# EAGLE design pam2803 (EAGLE 5.12)
DATABASE: ../../../partsdb.txt; PARTNO: CRL1206-FW-R820ELF
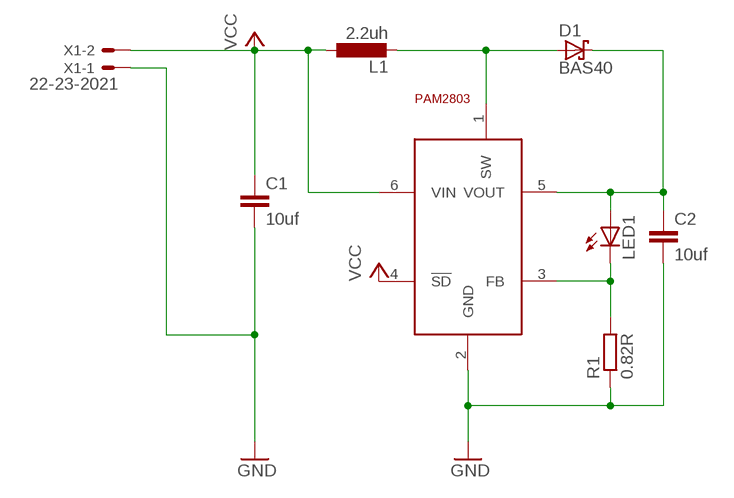
[diagram p0: schematic, sheet 1]

## Parts
C1  10uf  C-EUC1206  [C1206]
C2  10uf  C-EUC1206  [C1206]
D1  BAS40  [SOT23]
L1  2.2uh  L-EUL2012C  [L2012C]
LED1  LED5MM  [LED5MM]
R1  0.82R  R-EU_R1206  [R1206]
U$1  PAM2803  [SOT23-6]
X1  22-23-2021  [22-23-2021]

## Nets
GND: C1.2 C2.2 R1.1 U$1.2(GND) X1.1
LED+: C2.1 D1.3(C) LED1.A U$1.5(VOUT)
N$2: LED1.K(C) R1.2 U$1.3(FB)
N$3: D1.1(A) L1.2 U$1.1(SW)
VCC: C1.1 L1.1 U$1.4(!SD) U$1.6(VIN) X1.2

## Library data of the parts
C1 C2 = matt rcl:C-EU: CAPACITOR, European symbol
D1 = diode:BAS40: Silicon Schottky Diodes General-purpose diode for high-speed switching
L1 = matt rcl:L-EU: INDUCTOR, European symbol
LED1 = matt led:LED: LED OSRAM: - CHIPLED LG R971, LG N971, LY N971, LG Q971, LY Q971, LO R971, LY R971 LH N974, LH R974 LS Q976, LO Q976, LY Q976 LO Q996 - Hyper CHIPLED LW Q18S LB Q993, LB Q99A, LB R99A - SideLED LS A670, LO A670, LY A670, LG A670, LP A670 LB A673, LV A673, LT A673, LW A673 LH A674 LY A675 LS A676, LA A676, LO A676, LY A676, LW A676 LS A679, LY A679, LG A679 - Hyper Micro SIDELED® LS Y876, LA Y876, LO Y876, LY Y876 LT Y87S - SmartLED LW L88C, LW L88S LB L89C, LB L89S, LG L890 LS L89K, LO L89K, LY L89K LS L896, LA L896, LO L896, LY L896 - TOPLED LS T670, LO T670, LY T670, LG T670, LP T670 LSG T670, LSP T670, LSY T670, LOP T670, LYG T670 LG T671, LOG T671, LSG T671 LB T673, LV T673, LT T673, LW T673 LH T674 LS T676, LA T676, LO T676, LY T676, LB T676, LH T676, LSB T676, LW T676 LB T67C, LV T67C, LT T67C, LS T67K, LO T67K, LY T67K, LW E67C LS E67B, LA E67B, LO E67B, LY E67B, LB E67C, LV E67C, LT E67C LW T67C LS T679, LY T679, LG T679 LS T770, LO T770, LY T770, LG T770, LP T770 LB T773, LV T773, LT T773, LW T773 LH T774 LS E675, LA E675, LY E675, LS T675 LS T776, LA T776, LO T776, LY T776, LB T776 LHGB T686 LT T68C, LB T68C - Hyper Mini TOPLED® LB M676 - Mini TOPLED Santana® LG M470 LS M47K, LO M47K, LY M47K Source: http://www.osram.convergy.de LUXEON: - LUMILED® LXK2-PW12-R00, LXK2-PW12-S00, LXK2-PW14-U00, LXK2-PW14-V00 LXK2-PM12-R00, LXK2-PM12-S00, LXK2-PM14-U00 LXK2-PE12-Q00, LXK2-PE12-R00, LXK2-PE12-S00, LXK2-PE14-T00, LXK2-PE14-U00 LXK2-PB12-K00, LXK2-PB12-L00, LXK2-PB12-M00, LXK2-PB14-N00, LXK2-PB14-P00, LXK2-PB14-Q00 LXK2-PR12-L00, LXK2-PR12-M00, LXK2-PR14-Q00, LXK2-PR14-R00 LXK2-PD12-Q00, LXK2-PD12-R00, LXK2-PD12-S00 LXK2-PH12-R00, LXK2-PH12-S00 LXK2-PL12-P00, LXK2-PL12-Q00, LXK2-PL12-R00 Source: www.luxeon.com KINGBRIGHT: KA-3528ASYC Source: www.kingbright.com
R1 = matt rcl:R-EU_: RESISTOR, European symbol
U$1 = matt:PAM2803
X1 = con-molex:22-23-2021: .100" (2.54mm) Center Header - 2 Pin; MF: MOLEX; MPN: 22-23-2021; OC_FARNELL: 1462926; OC_NEWARK: 25C3832

## Board
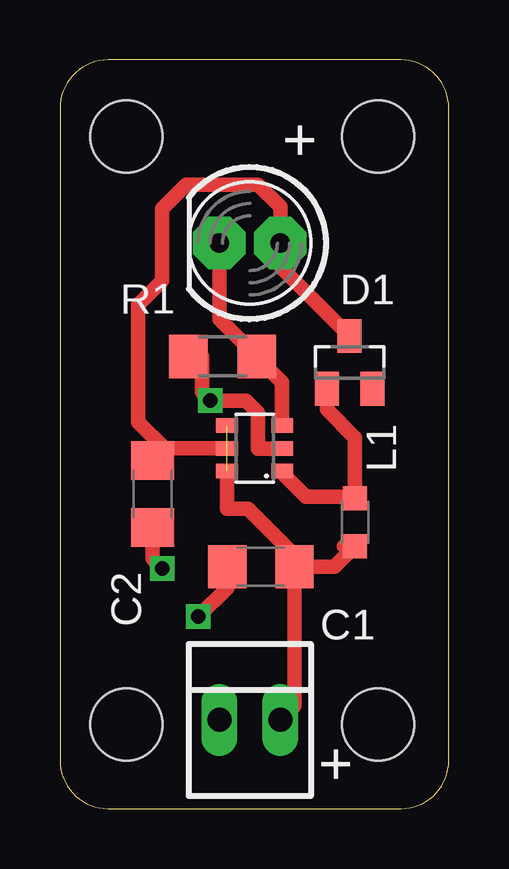
[diagram p1: board, top side]
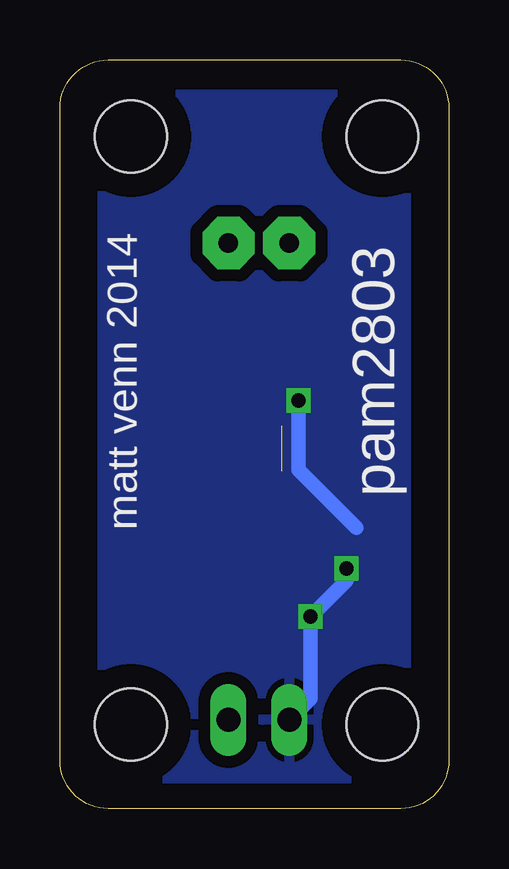
[diagram p2: board, bottom side, seen from below]

Size 16.22 x 31.19 mm. Coordinates in mm from the lower left corner, seen from the top.
Outline: 14.22,0 arc90 16.22,2 16.22,29.19 arc90 14.22,31.19 2,31.19 arc90 0,29.19 0,2 arc90 2,0 14.22,0
Copper layers (1*16): Top 0.035mm / dielectric 1.5mm / Bottom 0.035mm
Design rules "default": minimum track width 10mil, minimum drill 24mil, track to track 8mil, track to pad 8mil, pad to pad 8mil, via to via 8mil, smd to smd 8mil, copper to edge 40mil, drill to drill 8mil, minimum pad ring 10mil, minimum via ring 8mil, stop-mask expansion 4mil, vias tented up to drill 0mil, thermal gap 10mil
Holes 3 mm at 2.77,28 13.27,28 2.77,3.5 13.27,3.5

### Footprints (pad centres in the part's own frame; a part is rotated, then mirrored left to right if it is on the bottom)
C1206 = smd 1.6 x 1.8: 1 -1.4,0; 2 1.4,0
SOT23 = smd 1 x 1.4: 1 -0.95,-1.1; 2 0.95,-1.1; 3 0,1.1
L2012C = smd 1 x 1: 1 -1,0; 2 1,0
LED5MM = drill 0.813 pad 2.184 octagon: A -1.27,0; K 1.27,0
R1206 = smd 1.6 x 1.803: 1 -1.422,0; 2 1.422,0
SOT23-6 = smd 0.6 x 0.9: 1 -0.95,-1.15; 2 0,-1.15; 3 0.95,-1.15; 4 0.95,1.15; 5 0,1.15; 6 -0.95,1.15
22-23-2021 = drill 1 long: 1 -1.27,0; 2 1.27,0

### Placement (x,y rotation side)
C1  8.38,10.07 180 top
C2  3.86,13.11 270 top
D1  12.08,18.59 0 top
L1  12.31,11.93 90 top
LED1  7.92,23.56 180 top
R1  6.78,18.84 0 top
U$1  8.12,15.01 90 top
X1  7.92,3.69 0 top

### Tracks (layer width: path | path; a pad name or v marks a point on that pad's centre or on a via)
GND  (via drill 0.6)
  Top 0.61: R1.1 5.93,18.84 5.93,17.34 v6.27,17 7.77,17 8.27,16.5 8.27,15 U$1.2 | C1.2 6.98,9.21 v5.77,8 | C2.2 3.86,10.41 v4.27,10
  Bottom 0.61: X1.1 5.77,4.57 v5.77,8 4.27,9.5 v4.27,10 | v6.27,17 6.27,14.12 C2.2
  pour Bottom (isolate 0.5): 1.77,29.75 14.47,29.75 14.47,1.27 1.77,1.27
LED+
  Top 0.61: 4.36,15.01 U$1.5 | C2.1 4.36,15.01 | D1.3 9.19,22.58 LED1.A 9.19,25.08 8.27,26 5.27,26 4.27,25 4.27,22 3.27,21 3.27,16.1 4.36,15.01
N$2
  Top 0.61: LED1.K 6.65,20.39 R1.2 9.27,17.77 U$1.3
N$3
  Top 0.61: L1.2 11.84,12.93 | U$1.1 9.33,14 arc45 9.37,13.9 10.27,13 12.14,13 arc-45 L1.2 | D1.1 11.13,16.64 12.31,15.46 L1.2
VCC  (1 unrouted)
  Top 0.61: U$1.6 6.97,12.5 7.84,12.5 10.27,10.07 | 11.84,10.93 L1.1 11.45,10.07 10.27,10.07 | X1.2 9.78,4.28 C1.1 10.27,10.07

### Text on the board
tNames: + | +
bNames: matt venn 2014 | pam2803